# EAGLE schematic SEALD KRSBI BARU (EAGLE 9.5.0)
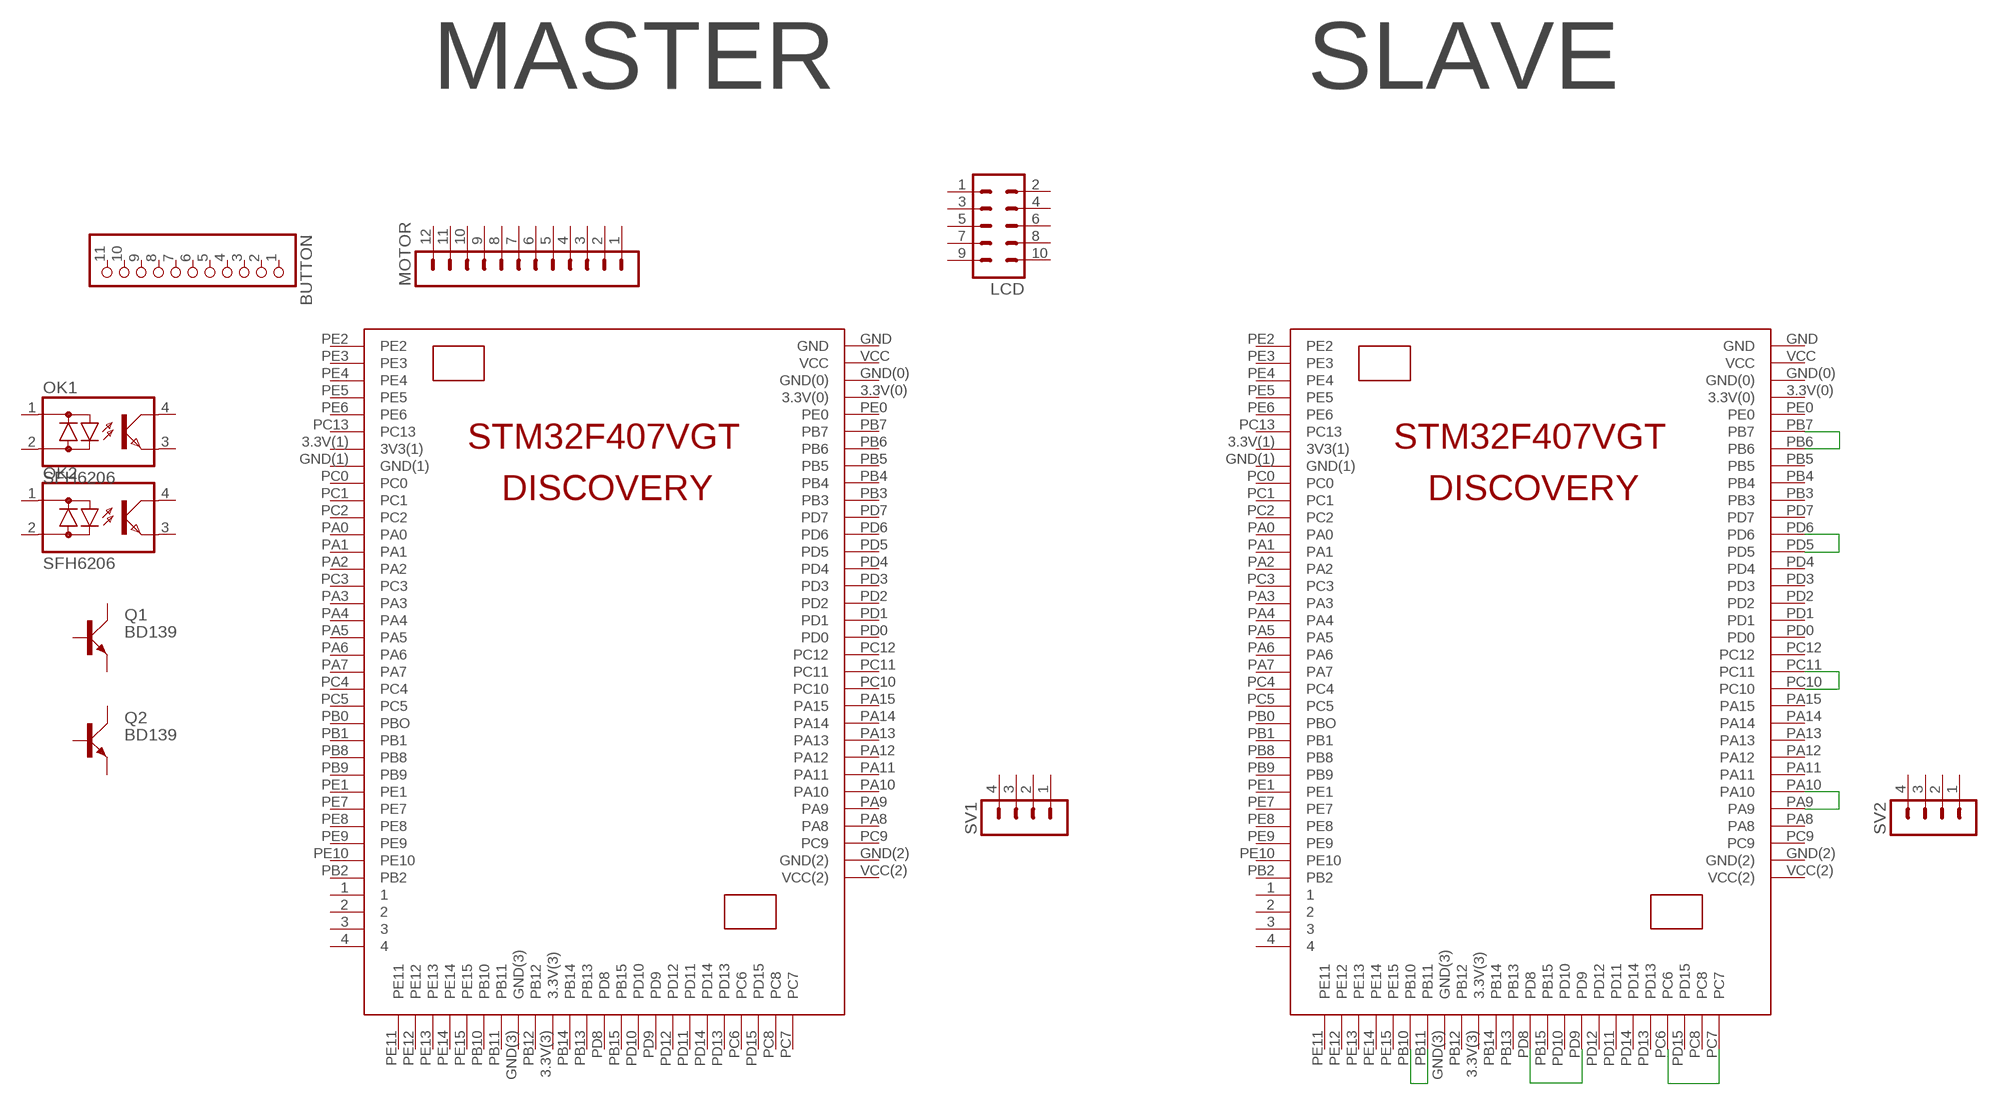
[diagram p0: schematic, sheet 1, part 1 of 2]
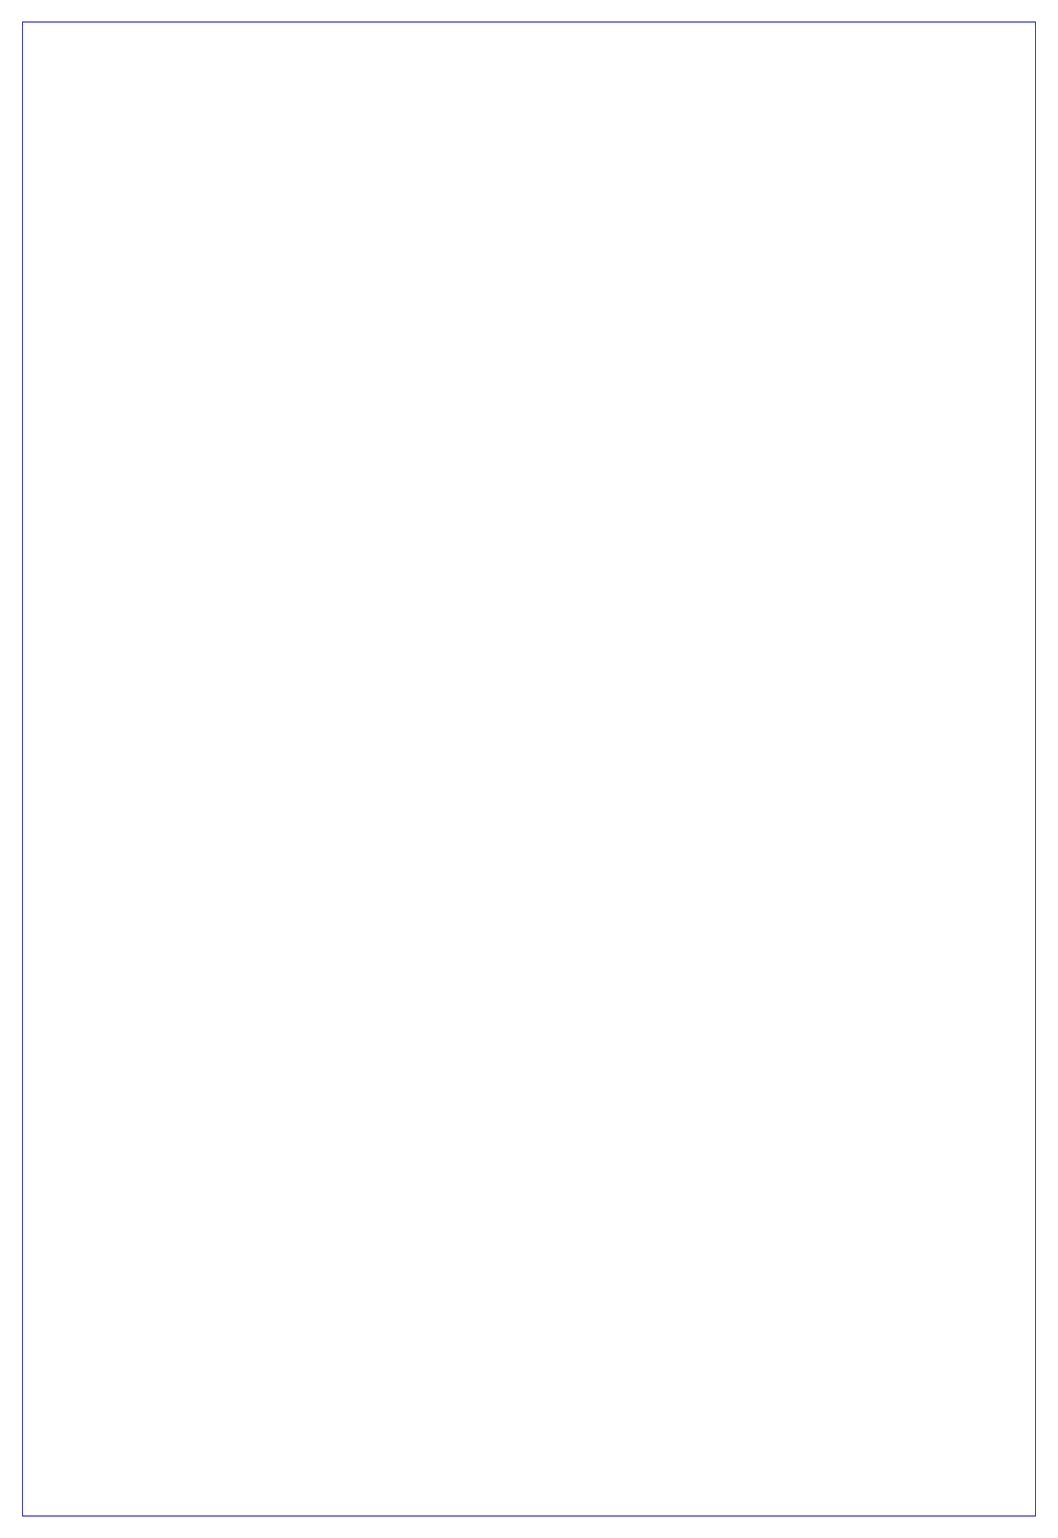
[diagram p1: schematic, sheet 1, part 2 of 2]

## Parts
BUTTON  PINHD-1X11  [1X11]
LCD  MA05-2  [MA05-2]
MOTOR  MA12-1  [MA12-1]
OK1  SFH6206  [DIL4-SMD]
OK2  SFH6206  [DIL4-SMD]
Q1  BD139  [TO126AV]
Q2  BD139  [TO126AV]
SV1  MA04-1  [MA04-1]
SV2  MA04-1  [MA04-1]
U$1  STM32F407(BOARD)  [STM32F407VGT]
U$2  STM32F407(BOARD)  [STM32F407VGT]

## Nets
N$6: U$1.PB10 U$1.PB11
N$7: U$1.PD8 U$1.PD9
N$8: U$1.PC6 U$1.PC7
N$9: U$1.PA9 U$1.PA10
N$10: U$1.PC10 U$1.PC11
N$11: U$1.PD5 U$1.PD6
N$12: U$1.PB6 U$1.PB7
Unconnected: BUTTON.1 BUTTON.2 BUTTON.3 BUTTON.4 BUTTON.5 BUTTON.6 BUTTON.7 BUTTON.8 BUTTON.9 BUTTON.10 BUTTON.11 LCD.1 LCD.2 LCD.3 LCD.4 LCD.5 LCD.6 LCD.7 LCD.8 LCD.9 LCD.10 MOTOR.1 MOTOR.2 MOTOR.3 MOTOR.4 MOTOR.5 MOTOR.6 MOTOR.7 MOTOR.8 MOTOR.9 MOTOR.10 MOTOR.11 MOTOR.12 OK1.1(AC1) OK1.2(AC2) OK1.3(E) OK1.4(C) OK2.1(AC1) OK2.2(AC2) OK2.3(E) OK2.4(C) Q1.B Q1.C Q1.E Q2.B Q2.C Q2.E SV1.1 SV1.2 SV1.3 SV1.4 SV2.1 SV2.2 SV2.3 SV2.4 U$1.1 U$1.2 U$1.3 U$1.3.3V(0) U$1.3.3V(1)(3V3(1)) U$1.3.3V(3) U$1.4 U$1.GND U$1.GND(0) U$1.GND(1) U$1.GND(2) U$1.GND(3) U$1.PA0 U$1.PA1 U$1.PA2 U$1.PA3 U$1.PA4 U$1.PA5 U$1.PA6 U$1.PA7 U$1.PA8 U$1.PA11 U$1.PA12 U$1.PA13 U$1.PA14 U$1.PA15 U$1.PB0(PBO) U$1.PB1 U$1.PB2 U$1.PB3 U$1.PB4 U$1.PB5 U$1.PB8 U$1.PB9 U$1.PB12 U$1.PB13 U$1.PB14 U$1.PB15 U$1.PC0 U$1.PC1 U$1.PC2 U$1.PC3 U$1.PC4 U$1.PC5 U$1.PC8 U$1.PC9 U$1.PC12 U$1.PC13 U$1.PD0 U$1.PD1 U$1.PD2 U$1.PD3 U$1.PD4 U$1.PD7 U$1.PD10 U$1.PD11 U$1.PD12 U$1.PD13 U$1.PD14 U$1.PD15 U$1.PE0 U$1.PE1 U$1.PE2 U$1.PE3 U$1.PE4 U$1.PE5 U$1.PE6 U$1.PE7 U$1.PE8 U$1.PE9 U$1.PE10 U$1.PE11 U$1.PE12 U$1.PE13 U$1.PE14 U$1.PE15 U$1.VCC U$1.VCC(2) U$2.1 U$2.2 U$2.3 U$2.3.3V(0) U$2.3.3V(1)(3V3(1)) U$2.3.3V(3) U$2.4 U$2.GND U$2.GND(0) U$2.GND(1) U$2.GND(2) U$2.GND(3) U$2.PA0 U$2.PA1 U$2.PA2 U$2.PA3 U$2.PA4 U$2.PA5 U$2.PA6 U$2.PA7 U$2.PA8 U$2.PA9 U$2.PA10 U$2.PA11 U$2.PA12 U$2.PA13 U$2.PA14 U$2.PA15 U$2.PB0(PBO) U$2.PB1 U$2.PB2 U$2.PB3 U$2.PB4 U$2.PB5 U$2.PB6 U$2.PB7 U$2.PB8 U$2.PB9 U$2.PB10 U$2.PB11 U$2.PB12 U$2.PB13 U$2.PB14 U$2.PB15 U$2.PC0 U$2.PC1 U$2.PC2 U$2.PC3 U$2.PC4 U$2.PC5 U$2.PC6 U$2.PC7 U$2.PC8 U$2.PC9 U$2.PC10 U$2.PC11 U$2.PC12 U$2.PC13 U$2.PD0 U$2.PD1 U$2.PD2 U$2.PD3 U$2.PD4 U$2.PD5 U$2.PD6 U$2.PD7 U$2.PD8 U$2.PD9 U$2.PD10 U$2.PD11 U$2.PD12 U$2.PD13 U$2.PD14 U$2.PD15 U$2.PE0 U$2.PE1 U$2.PE2 U$2.PE3 U$2.PE4 U$2.PE5 U$2.PE6 U$2.PE7 U$2.PE8 U$2.PE9 U$2.PE10 U$2.PE11 U$2.PE12 U$2.PE13 U$2.PE14 U$2.PE15 U$2.VCC U$2.VCC(2)

## Notes on the sheet
- MASTER | SLAVE

## Library data of the parts
BUTTON = pinhead:PINHD-1X11: PIN HEADER
LCD = con-lstb:MA05-2: PIN HEADER; OC_FARNELL: unknown; OC_NEWARK: unknown
MOTOR = con-lstb:MA12-1: PIN HEADER; OC_FARNELL: unknown; OC_NEWARK: unknown
OK1 OK2 = optocoupler:SFH620: Optocoupler, Phototransistor Output, AC Input Source: http://www.vishay.com/docs/83675/sfh620.pdf; MF: VISHAY/TELEFUNKEN; MPN: SFH6206-3; OC_FARNELL: 1469585; OC_NEWARK: 58K2214
Q1 Q2 = transistor-power:BD139: NPN TRANSISTOR
SV1 SV2 = con-lstb:MA04-1: PIN HEADER; OC_FARNELL: unknown; OC_NEWARK: unknown
U$1 U$2 = KRI COMPONENT:STM32F407(BOARD)